# Altium project Developer_GT06_V1.1.0.PrjPcb
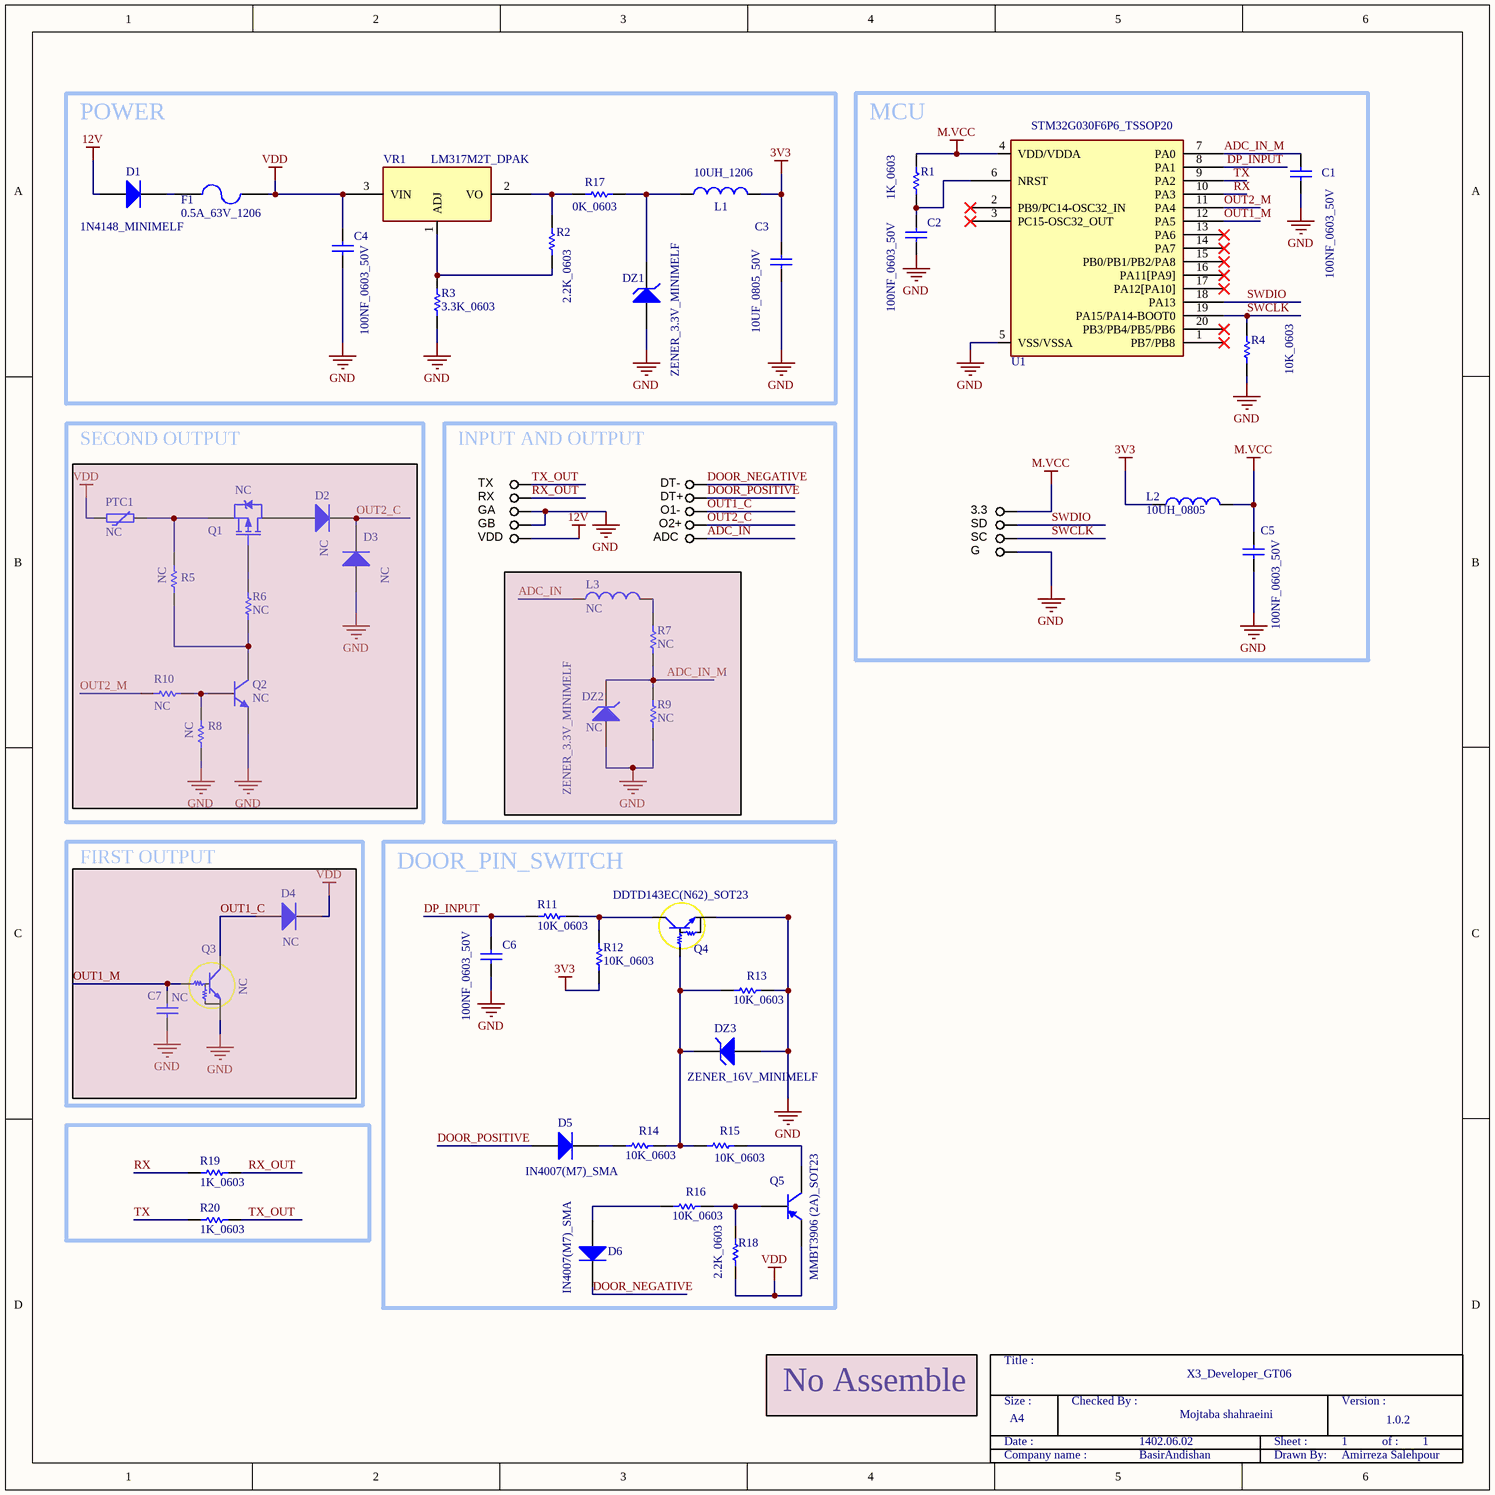
[diagram p0: Developer_GT06.SchDoc]
1 sheet, 62 parts. Net scope: global (net labels, ports and power ports of the same name join across sheets).
Board file: Developer_GT06.PcbDoc

## Sheet Developer_GT06.SchDoc: X3_Developer_GT06
size 279 x 279 mm; Date: 1402.06.02; CheckedBy: Mojtaba shahraeini; CompanyName: BasirAndishan; DrawnBy: Amirreza Salehpour; Revision: 1.0.2; SheetNumber: 1; SheetTotal: 1

### Parts
3.3  (no value)  [TPSMD_D1]  (net tie, no BOM)
ADC  (no value)  [TPSMD_D1]  (net tie, no BOM)
C1  100NF_0603_50V  [Cap_0603_Nominal]
C2  100NF_0603_50V  [Cap_0603_Nominal]
C3  10UF_0805_50V  [Cap_0805_Nominal]
C4  100NF_0603_50V  [Cap_0603_Nominal]
C5  100NF_0603_50V  [Cap_0603_Nominal]
C6  100NF_0603_50V  [Cap_0603_Nominal]
C7  NC  [Cap_0603_Nominal]
D1  1N4148_MINIMELF  [DIODE_SMA]
D2  NC  [DIODE_SMA]
D3  NC  [DIODE_SMA]
D4  NC  [DIODE_SMA]
D5  IN4007(M7)_SMA  [DIODE_SMA]
D6  IN4007(M7)_SMA  [DIODE_SMA]
DT+  (no value)  [TPSMD_D1]  (net tie, no BOM)
DT-  (no value)  [TPSMD_D1]  (net tie, no BOM)
DZ1  ZENER_3.3V_MINIMELF  [Diode_ZENER_MINIMELF]
DZ2  NC  value ZENER_3.3V_MINIMELF  [Diode_ZENER_MINIMELF]
DZ3  ZENER_16V_MINIMELF  [Diode_ZENER_MINIMELF]
F1  0.5A_63V_1206  [FUSE_1206_NOMINAL]
G  (no value)  [TPSMD_D1]  (net tie, no BOM)
GA  (no value)  [TPSMD_D1]  (net tie, no BOM)
GB  (no value)  [TPSMD_D1]  (net tie, no BOM)
L1  10UH_1206  [INDUCTOR_1206_NOMINAL]
L2  10UH_0805  [INDUCTOR_0805_Nominal]
L3  NC  [INDUCTOR_0805_Nominal]
O1-  (no value)  [TPSMD_D1]  (net tie, no BOM)
O2+  (no value)  [TPSMD_D1]  (net tie, no BOM)
PTC1  NC  [PTC_1812]
Q1  NC  [SOT23_MOSFET]
Q2  NC  [SOT23_BJT]
Q3  NC  [SOT23]
Q4  DDTD143EC(N62)_SOT23  [SOT23]
Q5  MMBT3906 (2A)_SOT23  [SOT23_BJT]
R1  1K_0603  [Res_0603_Nominal]
R2  2.2K_0603  [Res_0603_Nominal]
R3  3.3K_0603  [Res_0603_Nominal]
R4  10K_0603  [Res_0603_Nominal]
R5  NC  [Res_0603_Nominal]
R6  NC  [Res_0603_Nominal]
R7  NC  [Res_0603_Nominal]
R8  NC  [Res_0603_Nominal]
R9  NC  [Res_0603_Nominal]
R10  NC  [Res_0603_Nominal]
R11  10K_0603  [Res_0603_Nominal]
R12  10K_0603  [Res_0603_Nominal]
R13  10K_0603  [Res_0603_Nominal]
R14  10K_0603  [Res_0603_Nominal]
R15  10K_0603  [Res_0603_Nominal]
R16  10K_0603  [Res_0603_Nominal]
R17  0K_0603  [Res_0603_Nominal]
R18  2.2K_0603  [Res_0603_Nominal]
R19  1K_0603  [Res_0603_Nominal]
R20  1K_0603  [Res_0603_Nominal]
RX  (no value)  [TPSMD_D1]  (net tie, no BOM)
SC  (no value)  [TPSMD_D1]  (net tie, no BOM)
SD  (no value)  [TPSMD_D1]  (net tie, no BOM)
TX  (no value)  [TPSMD_D1]  (net tie, no BOM)
U1  STM32G030F6P6_TSSOP20  [SOG65_20]
VDD  (no value)  [TPSMD_D1]  (net tie, no BOM)
VR1  LM317M2T_DPAK  [DPAK]

### Blocks framed on the sheet
POWER: C3 C4 D1 DZ1 F1 L1 R2 R3 R17 VR1
MCU: 3.3 C1 C2 C5 G L2 R1 R4 SC SD U1
INPUT AND OUTPUT: ADC DT+ DT- DZ2 GA GB L3 O1- O2+ R7 R9 RX TX VDD
SECOND OUTPUT: D2 D3 PTC1 Q1 Q2 R5 R6 R8 R10
FIRST OUTPUT: C7 D4 Q3
DOOR_PIN_SWITCH: C6 D5 D6 DZ3 Q4 Q5 R11-R16 R18

### Nets
3V3: C3.2 L1.2 L2.1 R12.2
12V: D1.1(A) VDD.1
GND: C1.1 C2.1 C3.1 C4.1 C5.1 C6.1 C7.1 D3.1(A) DZ1.1(A) DZ2.1(A) DZ3.1(A) G.1 GA.1 GB.1 Q2.2(E) Q3.2(E) Q4.2(E) R3.2 R4.2 R8.2 R9.2 R13.1 U1.5(VSS/VSSA)
M.VCC: 3.3.1 C5.2 L2.2 R1.1 U1.4(VDD/VDDA)
VDD: C4.2 D4.2(K) F1.2 PTC1.1 Q5.2(E) R18.1 VR1.3(VIN)
ADC_IN: ADC.1 L3.1
ADC_IN_M: C1.2 DZ2.2(K) R7.2 R9.1 U1.7(PA0)
DOOR_NEGATIVE: D6.2(K) DT-.1
DOOR_POSITIVE: D5.1(A) DT+.1
DP_INPUT: C6.2 R11.1 U1.8(PA1)
OUT1_C: D4.1(A) O1-.1 Q3.3(C)
OUT1_M: C7.2 Q3.1(B) U1.12(PA5)
OUT2_C: D2.2(K) D3.2(K) O2+.1
OUT2_M: R10.2 U1.11(PA4)
RX: R19.1 U1.10(PA3)
RX_OUT: R19.2 RX.1
SWCLK: R4.1 SC.1 U1.19(PA15/PA14-BOOT0)
SWDIO: SD.1 U1.18(PA13)
TX: R20.1 U1.9(PA2)
TX_OUT: R20.2 TX.1
NetC2_2: C2.2 R1.2 U1.6(NRST)
NetD1_2: D1.2(K) F1.1
NetD2_1: D2.1(A) Q1.3(D)
NetD5_2: D5.2(K) R14.2
NetD6_1: D6.1(A) R16.2
NetDZ1_2: DZ1.2(K) L1.1 R17.2
NetDZ3_2: DZ3.2(K) Q4.1(B) R13.2 R14.1 R15.2
NetL3_2: L3.2 R7.1
NetPTC1_2: PTC1.2 Q1.2(S) R5.1
NetQ1_1: Q1.1(G) R6.1
NetQ2_1: Q2.1(B) R8.1 R10.1
NetQ2_3: Q2.3(C) R5.2 R6.2
NetQ4_3: Q4.3(C) R11.2 R12.1
NetQ5_1: Q5.1(B) R16.1 R18.2
NetQ5_3: Q5.3(C) R15.1
NetR2_1: R2.1 R17.1 VR1.2(VO)
NetR2_2: R2.2 R3.1 VR1.1(ADJ)

Not connected (* = marked no-connect by the designer): U1 1(PB7/PB8)* 2(PB9/PC14-OSC32_IN)* 3(PC15-OSC32_OUT)* 13(PA6)* 14(PA7)* 15(PB0/PB1/PB2/PA8)* 16(PA11[PA9])* 17(PA12[PA10])* 20(PB3/PB4/PB5/PB6)*

### Notes on the sheet
- Title :
- No Assemble
- Date :
- Size :
- A4
- Checked By :
- Sheet :
- Version :
- of :
- Company name :
- Drawn By:

### Library data of the parts
3.3 ADC DT+ DT- G GA GB O1- O2+ RX SC SD TX VDD = TESTPOINT_SMD: TEST POINT; MANF: MANF; MANF_P#: MANF_P#; VALUE: VALUE
C1-C4 C6 = Cap: Value: 100nF; Component ID: 000401
C5 = Cap: Component ID: 000401; Value: 100NF_0603_50V
C7 = Cap: 100NF_0603_50V; Component ID: 000401; Value: 100NF_0603_50V
D1 = Diode: Component ID: 000441
D2-D4 = Diode: IN4007(M7)_SMA; Component ID: 000448
D5 D6 = Diode: Component ID: 000448
DZ1 DZ2 = Diode_Zener: Component ID: 000449
  DZ1: Value: ZENER_3.3V_MINIMELF
DZ3 = Diode_Zener: Value: ZENER_5.1V_MINIMELF; Component ID: 000449
F1 = FUSE: Marking Code:F; Component ID: 002669
L1 = Inductor: Component ID: 002908
L2 = Inductor: Component ID: 003143
L3 = Inductor: 10UH_0805
PTC1 = PTC: TLC-MSMD050(Marking Code: T050)
Q1 = MOSFET-P: SI2309A(MS29)_SOT23; Published: 8-Jun-2000; LatestRevisionDate: 17-Jul-2002; LatestRevisionNote: Re-released for DXP Platform.; PackageVersion: 1995/1996; PackageReference: E3; Publisher: Altium Limited; PackageDescription: TO, Flat Index; 3 In-Line, Axial Leads; Body Dia. 4.6mm; Lead Dia. 0.5 mm (max)
Q2 = MMBT3904
Q3 = NPN_Digital: DDTD143EC(N62)_SOT23; Component ID: 000498
Q4 = NPN_Digital: Component ID: 000498
Q5 = MMBT3906
R1-R3 R17 = RES: Value: 10K_0603; Component ID: 000091
R4 R11-R16 R18 = RES: Component ID: 000091
  R4 R11-R16: Value: 10K_0603
  R18: Value: 2.2K_0603
R5 R6 R8 R10 = RES: 10K_0603; Component ID: 000091; Value: 10K_0603
R7 = RES: 22K_0603; Value: 3.3K_0603; Component ID: 000154
R9 = RES: 2.2K_0603; Value: 3.3K_0603; Component ID: 000154
R19 R20 = RES: Value: 3.3K_0603; Component ID: 000154
U1 = STM32G030x6: MCU, STM32 ARM 32-bit, Cortex M0, 64KB FLASH, 8KB SRAM; DESC: CAN, I2C, SPI, USART, USB; MANF: ST; MANF_P#: STM32F103C8T6; PARAM2: 2~3.6VCC, 72MHz, 2X12Bit ADC; PARAM: 64KB FLASH, 20KB SRAM, -40~85oC; VALUE: STM32F103; PRICE: 6$
VR1 = VREG_LM317_TO220: REG, Linear, Adjustable, 1.5A, TO-220; MANF_P#: LM317KC, LM317T, LM317HVT, LM317BTG; MANF: TI, ST, ON; PARAM: 1.5A; PARAM2: PARAM2; VALUE: LM317M2T